# Altium schematic sheet Circuit photorecepteur.SchDoc
size A4
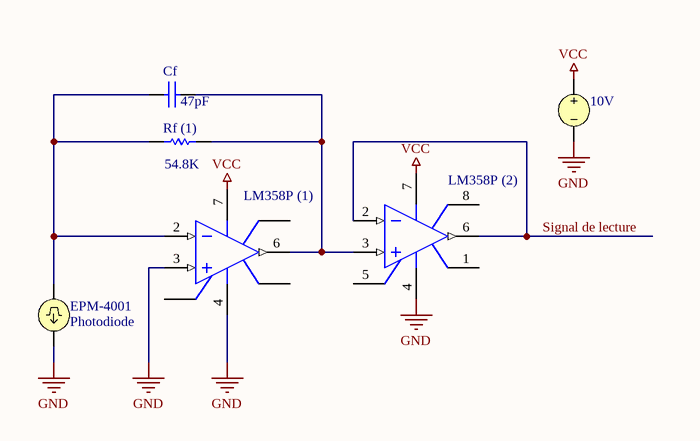
[diagram p0: Circuit photorecepteur.SchDoc]

## Parts
Cf  value 47pF  [RAD-0.3]  (hidden comment: Cap)
EPM-4001  Photodiode
LM358P_(1)  Op Amp  [H-08A]  (value not drawn)
LM358P_(2)  Op Amp  [H-08A]  (value not drawn)
Rf_(1)  value 54.8K  [AXIAL-0.3]  (hidden comment: Res1)
V1  value 10V  (hidden comment: VSRC)

## Nets
GND: EPM-4001.2 LM358P_(1).3(IN+) LM358P_(1).4(V-) LM358P_(2).4(V-) V1.2
VCC: LM358P_(1).7(V+) LM358P_(2).7(V+) V1.1
Signal de lecture: LM358P_(2).2(IN-) LM358P_(2).6(OUT)
NetCf_1: Cf.1 EPM-4001.1 LM358P_(1).2(IN-) Rf_(1).1
NetCf_2: Cf.2 LM358P_(1).6(OUT) LM358P_(2).3(IN+) Rf_(1).2

Not connected (* = marked no-connect by the designer): LM358P_(1) 1(OS_NUL) 5(OS_NUL) 8(TAB); LM358P_(2) 1(OS_NUL) 5(OS_NUL) 8(TAB)

## Library data of the parts
Cf = Cap: Capacitor; Published: 8-Jun-2000; LatestRevisionDate: 17-Jul-2002; LatestRevisionNote: Re-released for DXP Platform.; PackageReference: RAD-0.3; Publisher: Altium Limited; PackageDescription: Radial Cap, Thru-Hole; 2 Leads; 0.3 in Pin Spacing
EPM-4001 = IPULSE: Pulse Current Source; Published: 8-Jun-2000; LatestRevisionDate: 15-Nov-2004; LatestRevisionNote: Corrected Netlist.; PackageReference: Not Applicable; Publisher: Altium Limited
LM358P_(1) LM358P_(2) = Op Amp: FET Operational Amplifier; Published: 8-Jun-2000; LatestRevisionDate: 17-Jul-2002; LatestRevisionNote: Re-released for DXP Platform.; DatasheetVersion: REV. B; PackageVersion: 1990; PackageReference: H-08A; Publisher: Altium Limited; PackageDescription: Can; 8 Leads; Pin Circle Dia. 5.08 mm; Lead Dia. 0.53 mm (max); ComponentLink1Description: Manufacturer Link; ComponentLink1URL: http://www.analog.com/
Rf_(1) = Res1: Resistor; Published: 8-Jun-2000; LatestRevisionDate: 17-Jul-2002; LatestRevisionNote: Re-released for DXP Platform.; PackageReference: AXIAL-0.3; Publisher: Altium Limited; PackageDescription: Axial Device, Thru-Hole; 2 Leads; 0.3 in Pin Spacing
V1 = VSRC: Voltage Source; Note: PCB Footprint - Not required; Published: 8-Jun-2000; LatestRevisionDate: 17-Jul-2002; LatestRevisionNote: Re-released for DXP Platform.; PackageReference: Not Applicable; Publisher: Altium Limited